# EAGLE design esp32-pico-d4 (EAGLE 9.6.2)
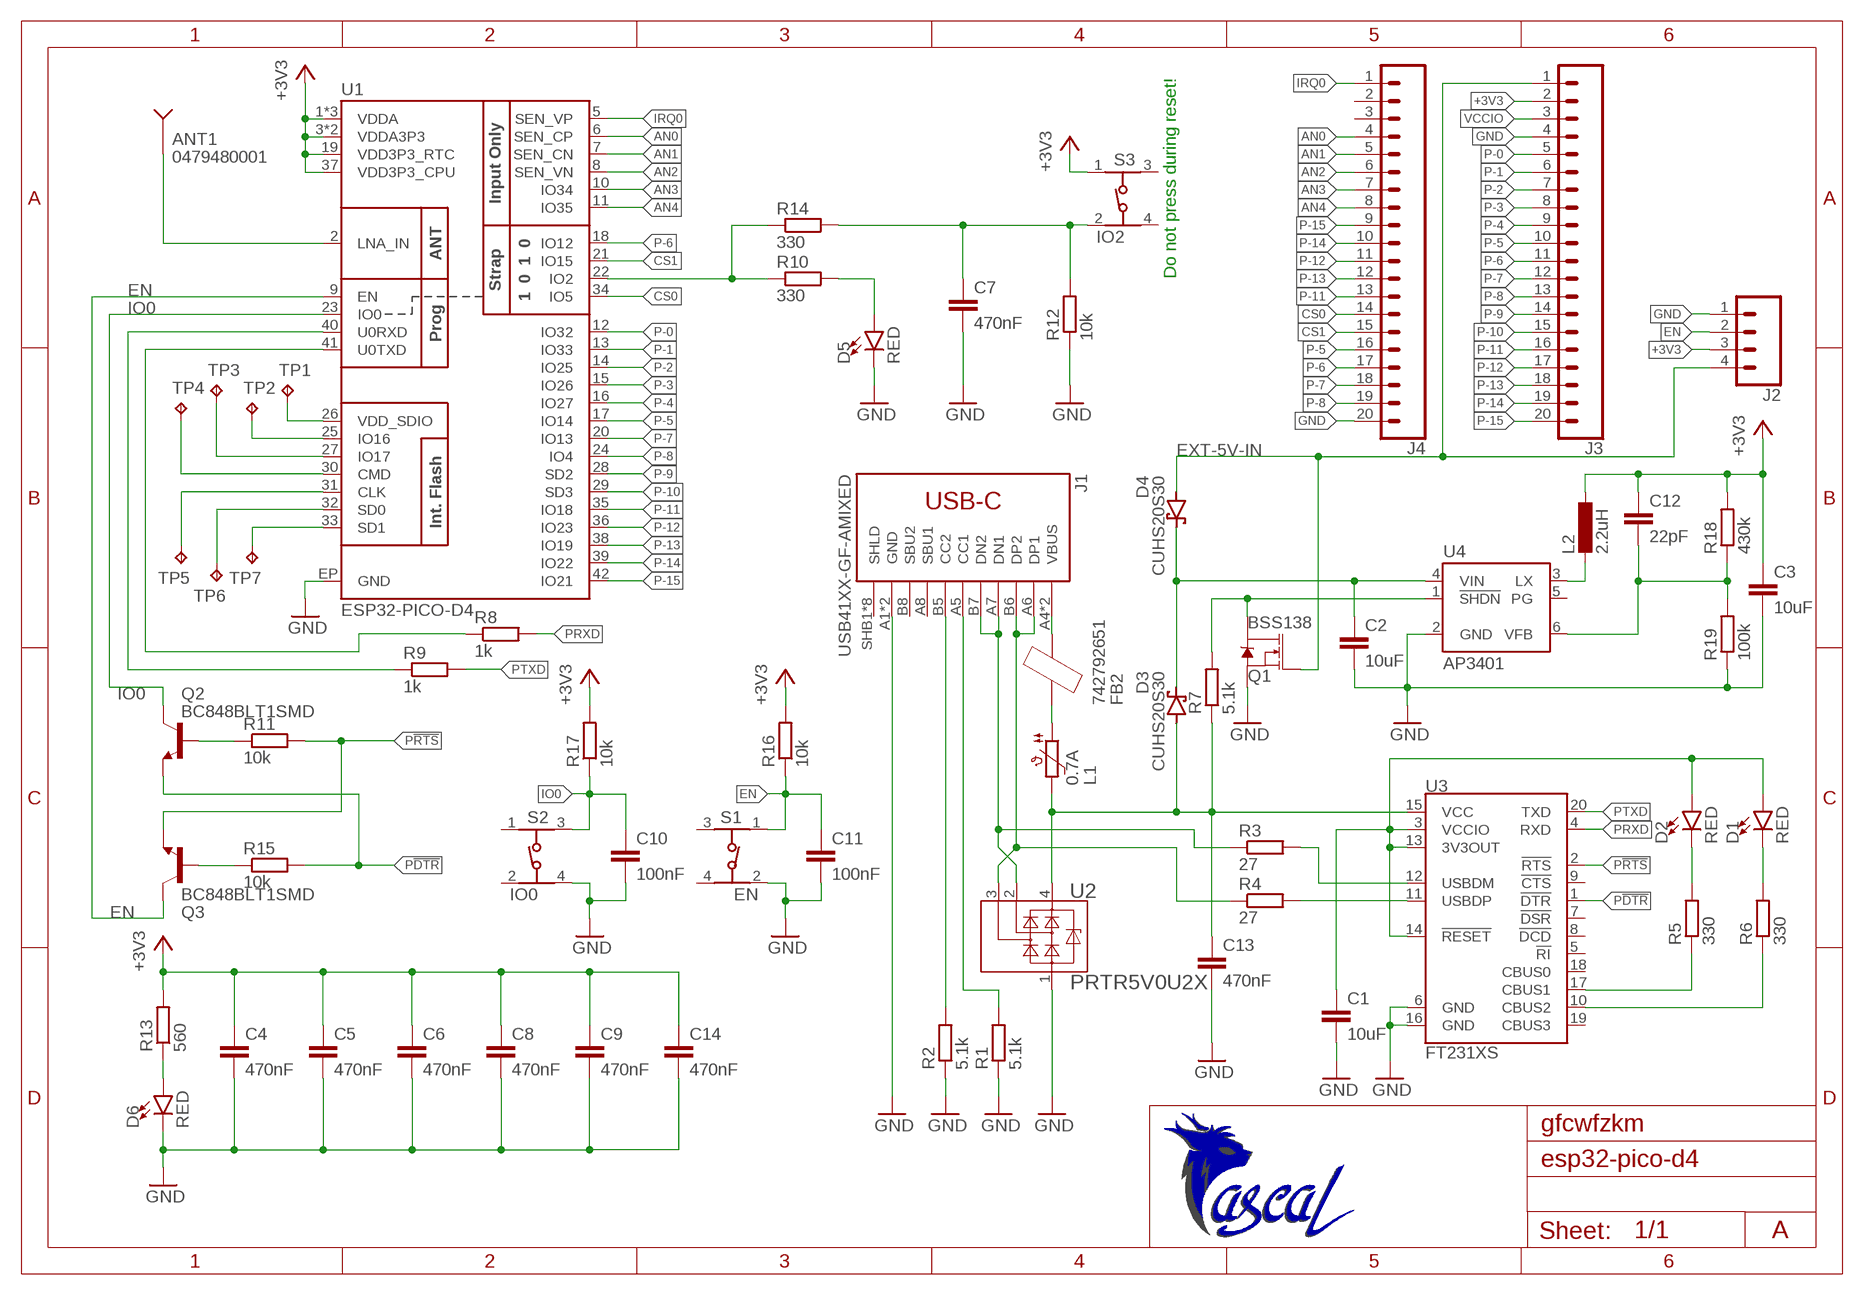
[diagram p0: schematic, sheet 1]

## Parts
ANT1  0479480001  ANT2.4G_MOLEX_0479480001  [RFANT2.4G_MOLEX_0479480001]
C1  10uF  C-EUC0603  [C0603]
C2  10uF  C-EUC0603  [C0603]
C3  10uF  C-EUC0603  [C0603]
C4  470nF  C-EUC0603  [C0603]
C5  470nF  C-EUC0603  [C0603]
C6  470nF  C-EUC0603  [C0603]
C7  470nF  C-EUC0603  [C0603]
C8  470nF  C-EUC0603  [C0603]
C9  470nF  C-EUC0603  [C0603]
C10  100nF  C-EUC0603  [C0603]
C11  100nF  C-EUC0603  [C0603]
C12  22pF  C-EUC0603  [C0603]
C13  470nF  C-EUC0603  [C0603]
C14  470nF  C-EUC0603  [C0603]
D1  RED  LED-RED0603  [LED-0603]
D2  RED  LED-RED0603  [LED-0603]
D3  CUHS20S30  [US2H]
D4  CUHS20S30  [US2H]
D5  RED  LED-RED0603  [LED-0603]
D6  RED  LED-RED0603  [LED-0603]
FB2  742792651  FERRITE_BEAD  [R0603]
J1  USB41XX-GF-AMIXED  [USB4105-GF-A]
J2  CONN_04  [1X04]
J3  CONN_20  [1X20]
J4  CONN_20  [1X20]
L1  0.7A  PTC_FUSE0805  [R0805]
L2  2.2uH  L0805  [R0805]
Q1  BSS138  MOSFET-NCH-BSS138  [SOT23-3]
Q2  BC848BLT1SMD  [SOT23]
Q3  BC848BLT1SMD  [SOT23]
R1  5.1k  R-EU_R0603  [R0603]
R2  5.1k  R-EU_R0603  [R0603]
R3  27  R-EU_R0603  [R0603]
R4  27  R-EU_R0603  [R0603]
R5  330  R-EU_R0603  [R0603]
R6  330  R-EU_R0603  [R0603]
R7  5.1k  R-EU_R0603  [R0603]
R8  1k  R-EU_R0603  [R0603]
R9  1k  R-EU_R0603  [R0603]
R10  330  R-EU_R0603  [R0603]
R11  10k  R-EU_R0603  [R0603]
R12  10k  R-EU_R0603  [R0603]
R13  560  R-EU_R0603  [R0603]
R14  330  R-EU_R0603  [R0603]
R15  10k  R-EU_R0603  [R0603]
R16  10k  R-EU_R0603  [R0603]
R17  10k  R-EU_R0603  [R0603]
R18  430k  R-EU_R0603  [R0603]
R19  100k  R-EU_R0603  [R0603]
S1  EN  434153017835  [434153017835]
S2  IO0  434153017835  [434153017835]
S3  IO2  434153017835  [434153017835]
TP1  TPB1,27  [B1,27]
TP2  TPB1,27  [B1,27]
TP3  TPB1,27  [B1,27]
TP4  TPB1,27  [B1,27]
TP5  TPB1,27  [B1,27]
TP6  TPB1,27  [B1,27]
TP7  TPB1,27  [B1,27]
U1  ESP32-PICO-D4  [QFN-48-ESP32]
U2  PRTR5V0U2X  [SOT143B]
U3  FT231XS  [SSOP20_L]
U4  AP3401  [TSOT23-6]
U$1  LOGO_PASCAL_GESELL10MM  [LOGO_10MM]

## Nets
!SHDN: Q1.3(D) R7.2 U4.1(!SHDN)
+3V3: C3.1 C4.1 C5.1 C6.1 C8.1 C9.1 C12.1 C14.1 J2.3 J3.2 L2.1 R13.2 R16.2 R17.2 R18.2 S3.1 U1.1(VDDA) U1.3(VDDA3P3) U1.4(VDDA3P3) U1.19(VDD3P3_RTC) U1.37(VDD3P3_CPU) U1.43(VDDA) U1.46(VDDA)
AN0: J4.4 U1.6(SEN_CP)
AN1: J4.5 U1.7(SEN_CN)
AN2: J4.6 U1.8(SEN_VN)
AN3: J4.7 U1.10(IO34)
AN4: J4.8 U1.11(IO35)
CS0: J4.14 U1.34(IO5)
CS1: J4.15 U1.21(IO15)
EN: C11.1 J2.2 Q3.3(C) R16.1 S1.1 U1.9(EN)
EXT-5V-IN: D4.A J2.4 J3.1 Q1.1(G)
GND: C1.2 C2.2 C3.2 C4.2 C5.2 C6.2 C7.2 C8.2 C9.2 C10.2 C11.2 C13.2 C14.2 D5.C D6.C J1.A1(GND) J1.B1(GND) J2.1 J3.4 J4.20 Q1.2(S) R1.1 R2.1 R12.1 R19.1 S1.2 S2.4 U1.EP(GND) U2.1 U3.6(GND) U3.16(GND) U4.2(GND)
IO0: C10.1 Q2.3(C) R17.1 S2.3 U1.23(IO0)
IRQ0: J4.1 U1.5(SEN_VP)
LEDBTN: R10.1 R14.1 U1.22(IO2)
LX: L2.2 U4.3(LX)
N$1: ANT1.RF(ANTENNA) U1.2(LNA_IN)
N$2: J1.B5(CC2) R2.2
N$3: J1.A5(CC1) R1.2
N$4: C13.1 D3.A L1.2 R7.1 U2.4 U3.15(VCC)
N$5: FB2.1 L1.1
N$6: J1.A6(DP1) J1.B6(DP2) R4.1 U2.3
N$7: J1.A7(DN1) J1.B7(DN2) R3.1 U2.2
N$8: R4.2 U3.11(USBDP)
N$9: C1.1 D1.A D2.A U3.3(VCCIO) U3.13(3V3OUT) U3.14(!RESET)
N$10: R3.2 U3.12(USBDM)
N$11: D2.C R5.2
N$12: D1.C R6.2
N$13: R5.1 U3.17(CBUS1)
N$14: R6.1 U3.10(CBUS2)
N$16: R8.1 U1.41(U0TXD)
N$17: R9.1 U1.40(U0RXD)
N$18: Q3.1(B) R15.1
N$19: D5.A R10.2
N$20: C7.1 R12.2 R14.2 S3.2
N$21: D6.A R13.1
N$22: Q2.1(B) R11.1
N$23: TP1.TP U1.26(VDD_SDIO)
N$24: TP2.TP U1.25(IO16)
N$25: TP3.TP U1.27(IO17)
N$26: TP4.TP U1.30(CMD)
N$27: TP7.TP U1.33(SD1)
N$28: TP6.TP U1.32(SD0)
N$29: TP5.TP U1.31(CLK)
P!DTR: Q2.2(E) R15.2 U3.1(!DTR)
P!RTS: Q3.2(E) R11.2 U3.2(!RTS)
P-0: J3.5 U1.12(IO32)
P-1: J3.6 U1.13(IO33)
P-2: J3.7 U1.14(IO25)
P-3: J3.8 U1.15(IO26)
P-4: J3.9 U1.16(IO27)
P-5: J3.10 J4.16 U1.17(IO14)
P-6: J3.11 J4.17 U1.18(IO12)
P-7: J3.12 J4.18 U1.20(IO13)
P-8: J3.13 J4.19 U1.24(IO4)
P-9: J3.14 U1.28(SD2)
P-10: J3.15 U1.29(SD3)
P-11: J3.16 J4.13 U1.35(IO18)
P-12: J3.17 J4.11 U1.36(IO23)
P-13: J3.18 J4.12 U1.38(IO19)
P-14: J3.19 J4.10 U1.39(IO22)
P-15: J3.20 J4.9 U1.42(IO21)
PRXD: R8.2 U3.4(RXD)
PTXD: R9.2 U3.20(TXD)
VBUS: FB2.2 J1.A4(VBUS) J1.B4(VBUS)
VCCIO: J3.3
VFB: C12.2 R18.1 R19.2 U4.6(VFB)
VIN: C2.1 D3.C D4.C U4.4(VIN)
Unconnected: J1.A8(SBU1) J1.B8(SBU2) J1.SHB1(SHLD) J1.SHB2(SHLD) J1.SHB3(SHLD) J1.SHB4(SHLD) J1.SHT1(SHLD) J1.SHT2(SHLD) J1.SHT3(SHLD) J1.SHT4(SHLD) J4.2 J4.3 S1.3 S1.4 S2.1 S2.2 S3.3 S3.4 U3.5(!RI) U3.7(!DSR) U3.8(!DCD) U3.9(!CTS) U3.18(CBUS0) U3.19(CBUS3) U4.5(PG)

## Notes on the sheet
- Do not press during reset!
- gfcwfzkm
- A

## Library data of the parts
ANT1 = Pascal_Library:ANT2.4G_MOLEX_0479480001: https://www.digikey.ch/product-detail/de/molex/0479480001/WM4893CT-ND/2683664
C1-C14 = rcl:C-EU: CAPACITOR, European symbol; SPICEPREFIX: C
D1 D2 D5 D6 = SparkFun-LED:LED-RED: Red SMD LED Used in manufacturing of most products at SparkFun Packages: 0603 - SMD 0603 package [Product Link] <http://docs.avagotech.com/docs/AV02-0551EN> 0603 SMART - SMD 0603 SMART package ( more efficient and expensive)[Product Link] <http://www.osram-os.com/Graphics/XPic2/00077099_0.pdf> 1206 - SMD1206 package [Product Link] <https://www.sparkfun.com/datasheets/DevTools/LilyPad/Q150OVS4.pdff> SparkFun Products: Pro Mini 328 -5V <https://www.sparkfun.com/products/821> RedBoard <https://www.sparkfun.com/products/12757> IOIO-OTG <https://www.sparkfun.com/products/13613>; PROD_ID: DIO-00819
D3 D4 = Elektroniker MGB:CUHS: CUHSxx High Speed Schottky Barrier Diode Series With a Very Low Vf Voltage CUHS15F40 <https://toshiba.semicon-storage.com/info/docget.jsp?did=63603&prodName=CUHS15F40>, CUHS20S30 <https://toshiba.semicon-storage.com/info/docget.jsp?did=63606&prodName=CUHS20S30>, CUHS20S40 <https://toshiba.semicon-storage.com/info/docget.jsp?did=63610&prodName=CUHS20S40>, CUHS20F30 <https://toshiba.semicon-storage.com/info/docget.jsp?did=63604&prodName=CUHS20F30>, CUHS20F40 <https://toshiba.semicon-storage.com/info/docget.jsp?did=63600&prodName=CUHS20F40>
FB2 = Elektroniker MGB:FERRITE_BEAD
J1 = Pascal_Library:USB41XX-GF-A
J2 = SparkFun-Connectors:CONN_04: Multi connection point. Often used as Generic Header-pin footprint for 0.1 inch spaced/style header connections On any of the 0.1 inch spaced packages, you can populate with these: Break Away Headers - Straight <https://www.sparkfun.com/products/116> (PRT-00116) Break Away Male Headers - Right Angle <https://www.sparkfun.com/products/553> (PRT-00553) Female Headers <https://www.sparkfun.com/products/115> (PRT-00115) Break Away Headers - Machine Pin <https://www.sparkfun.com/products/117> (PRT-00117) Break Away Female Headers - Swiss Machine Pin <https://www.sparkfun.com/products/743> (PRT-00743) For SCREWTERMINALS and SPRING TERMINALS visit here: Screw Terimnals on SparkFun.com <https://www.sparkfun.com/search/results?term=Screw+Terminals> (5mm/3.5mm/2.54mm spacing) This device is also useful as a general connection point to wire up your design to another part of your project. Our various solder wires solder well into these plated through hole pads. Hook-Up Wire - Assortment (Stranded, 22 AWG) <https://www.sparkfun.com/products/11375> (PRT-11375) Hook-Up Wire - Assortment (Solid Core, 22 AWG) <https://www.sparkfun.com/products/11367> (PRT-11367) View the entire wire category on our website here <https://www.sparkfun.com/categories/141> Special notes: Molex polarized connector foot print use with SKU : PRT-08231 with associated crimp pins and housings. 1MM SMD Version SKU: PRT-10208; PROD_ID: CONN-09696
J3 J4 = SparkFun-Connectors:CONN_20: Multi connection point. Often used as Generic Header-pin footprint for 0.1 inch spaced/style header connections On any of the 0.1 inch spaced packages, you can populate with these: Break Away Headers - Straight <https://www.sparkfun.com/products/116> (PRT-00116) Break Away Male Headers - Right Angle <https://www.sparkfun.com/products/553> (PRT-00553) Female Headers <https://www.sparkfun.com/products/115> (PRT-00115) Break Away Headers - Machine Pin <https://www.sparkfun.com/products/117> (PRT-00117) Break Away Female Headers - Swiss Machine Pin <https://www.sparkfun.com/products/743> (PRT-00743) For SCREWTERMINALS and SPRING TERMINALS visit here: Screw Terimnals on SparkFun.com <https://www.sparkfun.com/search/results?term=Screw+Terminals> (5mm/3.5mm/2.54mm spacing) This device is also useful as a general connection point to wire up your design to another part of your project. Our various solder wires solder well into these plated through hole pads. Hook-Up Wire - Assortment (Stranded, 22 AWG) <https://www.sparkfun.com/products/11375> (PRT-11375) Hook-Up Wire - Assortment (Solid Core, 22 AWG) <https://www.sparkfun.com/products/11367> (PRT-11367) View the entire wire category on our website here <https://www.sparkfun.com/categories/141> Special notes: Molex polarized connector foot print use with SKU : PRT-08231 with associated crimp pins and housings. 1MM SMD Version SKU: PRT-10208 NOTES ON THE VARIANTS LOCK and LOCK_LONGPADS... This footprint was designed to help hold the alignment of a through-hole component (i.e. 6-pin header) while soldering it into place. You may notice that each hole has been shifted either up or down by 0.005 of an inch from it's more standard position (which is a perfectly straight line). This slight alteration caused the pins (the squares in the middle) to touch the edges of the holes. Because they are alternating, it causes a "brace" to hold the component in place. 0.005 has proven to be the perfect amount of "off-center" position when using our standard breakaway headers. Although looks a little odd when you look at the bare footprint, once you have a header in there, the alteration is very hard to notice. Also,if you push a header all the way into place, it is covered up entirely on the bottom side. Note about LOCK SPECIAL package: This is just like the LOCK variant in that the holes are staggared by 5 mil, but except for the last two holes. They are not altered from the "standard" footprint layout. This is used for a special purpose on the layout of our Graphic LCD Backpack. Make sure you want to use this device before selecting it for you project!
L1 = Elektroniker MGB:PTC_FUSE
L2 = Pascal_Library:L
Q1 = SparkFun-DiscreteSemi:MOSFET-NCH: N-channel MOSFETs Voltage controlled devices that allow control of high current outputs. SparkFun Products: SparkFun OpenScale <https://www.sparkfun.com/products/13261> SparkFun Digital Sandbox <https://www.sparkfun.com/products/12651> SparkFun Monster Moto Shield <https://www.sparkfun.com/products/10182> SparkFun MOSFET Power Controller <https://www.sparkfun.com/products/11214>; PROD_ID: TRANS-00830; VALUE: 220mA/50V/3.5Ω
Q2 Q3 = transistor-npn:BC848*: NPN Transistor
R1-R19 = rcl:R-EU_: RESISTOR, European symbol; SPICEPREFIX: R
S1-S3 = Wurth_Switch_WS-TASV:434153017835: WS-TASV J-Bend SMT Tact Switch 3.5x2.9 mm Material Properties Cover Material : Stainless Steel Properties Actuator Material:LCP Actuator Flammability Rating:UL94 V-0 Actuator Color:Blue Frame Material:PA46 Frame Flammability Rating:UL94 HB Frame Color:Black Contact Material:Stainless Steel Contact Plating:Silver Terminal Material:Copper Alloy Terminal Plating:Silver VR:12 V (DC) Contact Resistance Initial:100 mΩ Contact Resistance After Life Test:1 Ω RISO:100 MΩ Withstanding Voltage:250 V (AC) Washable:No Qty.:4000 Mechanical Properties Stroke :0.15 mm General Information Operating Temperature:-40 up to +85 °C Washable:No Packaging Properties Packaging:Tape and Reel <https://www.we-online.com/catalog/media/o72753v209%20WS-TASU_434331013822_a_4C.jpg> Details see: https://www.we-online.com/catalog/en/TASV_3_5X2_9_SMD_J-BEND/ Updated by yingchun,Shan;2020-02-18 2020(C) Würth Elektronik; DATASHEET-URL: https://www.we-online.com/catalog/datasheet/434153017835.pdf; H: 1.7mm; OPERATION-FORCE: 350g; PART-NUMBER: 434153017835; QTY: 4000
TP1-TP7 = testpad:TP: Test pad
U1 = Pascal_Library:ESP32-PICO-D4: https://www.digikey.ch/product-detail/de/espressif-systems/ESP32-PICO-D4/1904-1029-1-ND/9381738
U2 = Elektroniker MGB:PRTR5V0U2X: PRTR5V0U2X - Ultra low capacitance double rail-to-rail ESD protection diode Ultra low capacitance rail-to-rail ElectroStatic Discharge (ESD) protection diode in a small SOT143B Surface-Mounted Device (SMD) plastic package designed to protect two Hi-Speed data lines or high-frequency signal lines from the damage caused by ESD and other transients. PRTR5V0U2X incorporates two pairs of ultra low capacitance rail-to-rail diodes as well as an additional ESD protection diode to ensure signal line protection even if no supply voltage is available.
U3 = SparkFun-IC-Comms:FT231X: FTDI FT231X Full Speed USB to Full-handshake UART This USB2.0 Full Speed IC offers a compact bridge to full handshake UART interfaces. The device is a UART, capable of operating up to 3MBaud, with low power consumption (8mA). The FT231X includes the complete FT-X series feature set and enables USB to be added into a system design quickly and easily over a UART interface. Datasheet <http://cdn.sparkfun.com/datasheets/Components/General%20IC/DS_FT231X.pdf> SparkFun Products SparkFun RedBoard - Programmed with Arduino <https://www.sparkfun.com/products/12757> (DEV-12757) SparkFun XBee Explorer USB <https://www.sparkfun.com/products/11812> (WRL-11812) SparkFun XBee Explorer Dongle <https://www.sparkfun.com/products/11697> (WRL-11697) SparkFun Blynk Board - ESP8266 <https://www.sparkfun.com/products/13794> (WRL-13794) SparkFun ESP8266 Thing - Dev Board <https://www.sparkfun.com/products/13711> (WRL-13711) SparkFun Block for Intel® Edison - Base <https://www.sparkfun.com/products/13045> (DEV-13045) SparkFun RedStick <https://www.sparkfun.com/products/13741> (DEV-13741) SparkFun Beefy 3 - FTDI Basic Breakout <https://www.sparkfun.com/products/13746> (DEV-13746) SparkFun FT231X Breakout <https://www.sparkfun.com/products/11736> (BOB-11736); PROD_ID: IC-11524
U4 = Pascal_Library:AP3401
U$1 = Pascal_Library:LOGO_PASCAL_GESELL: Mein Logo halt

## Board
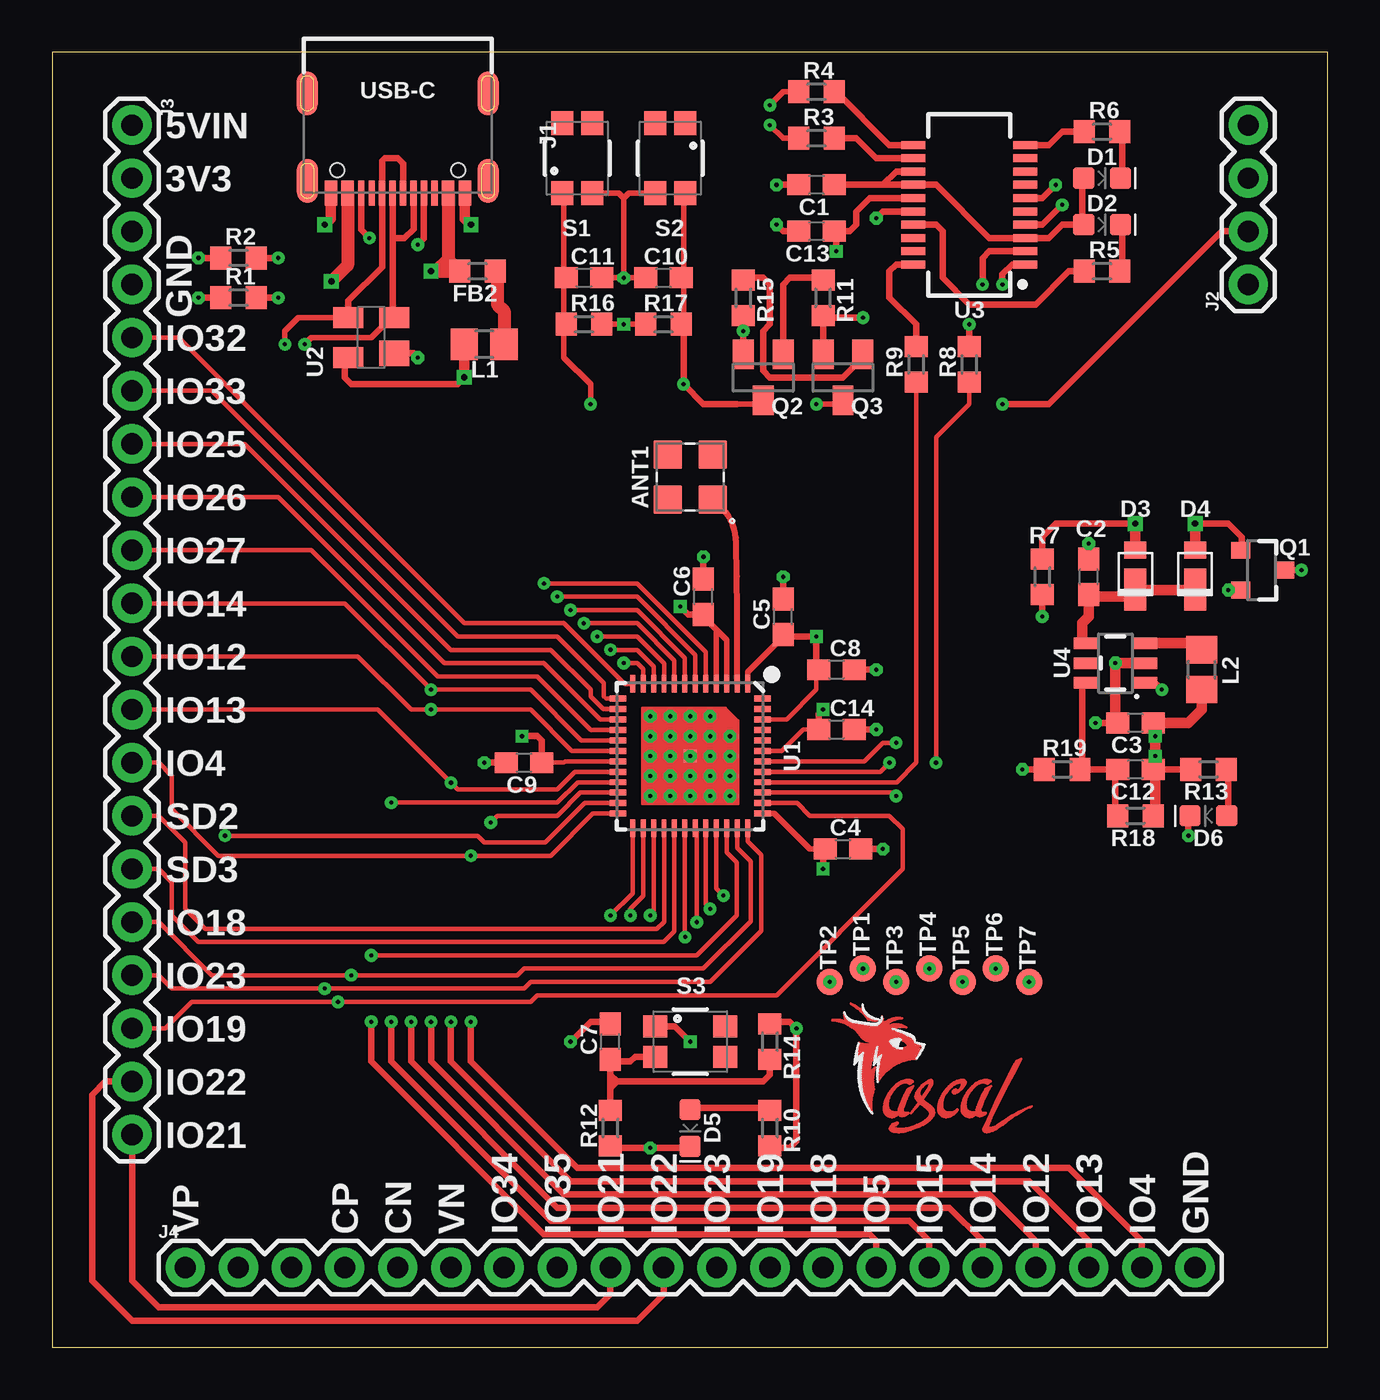
[diagram p1: board, top side]
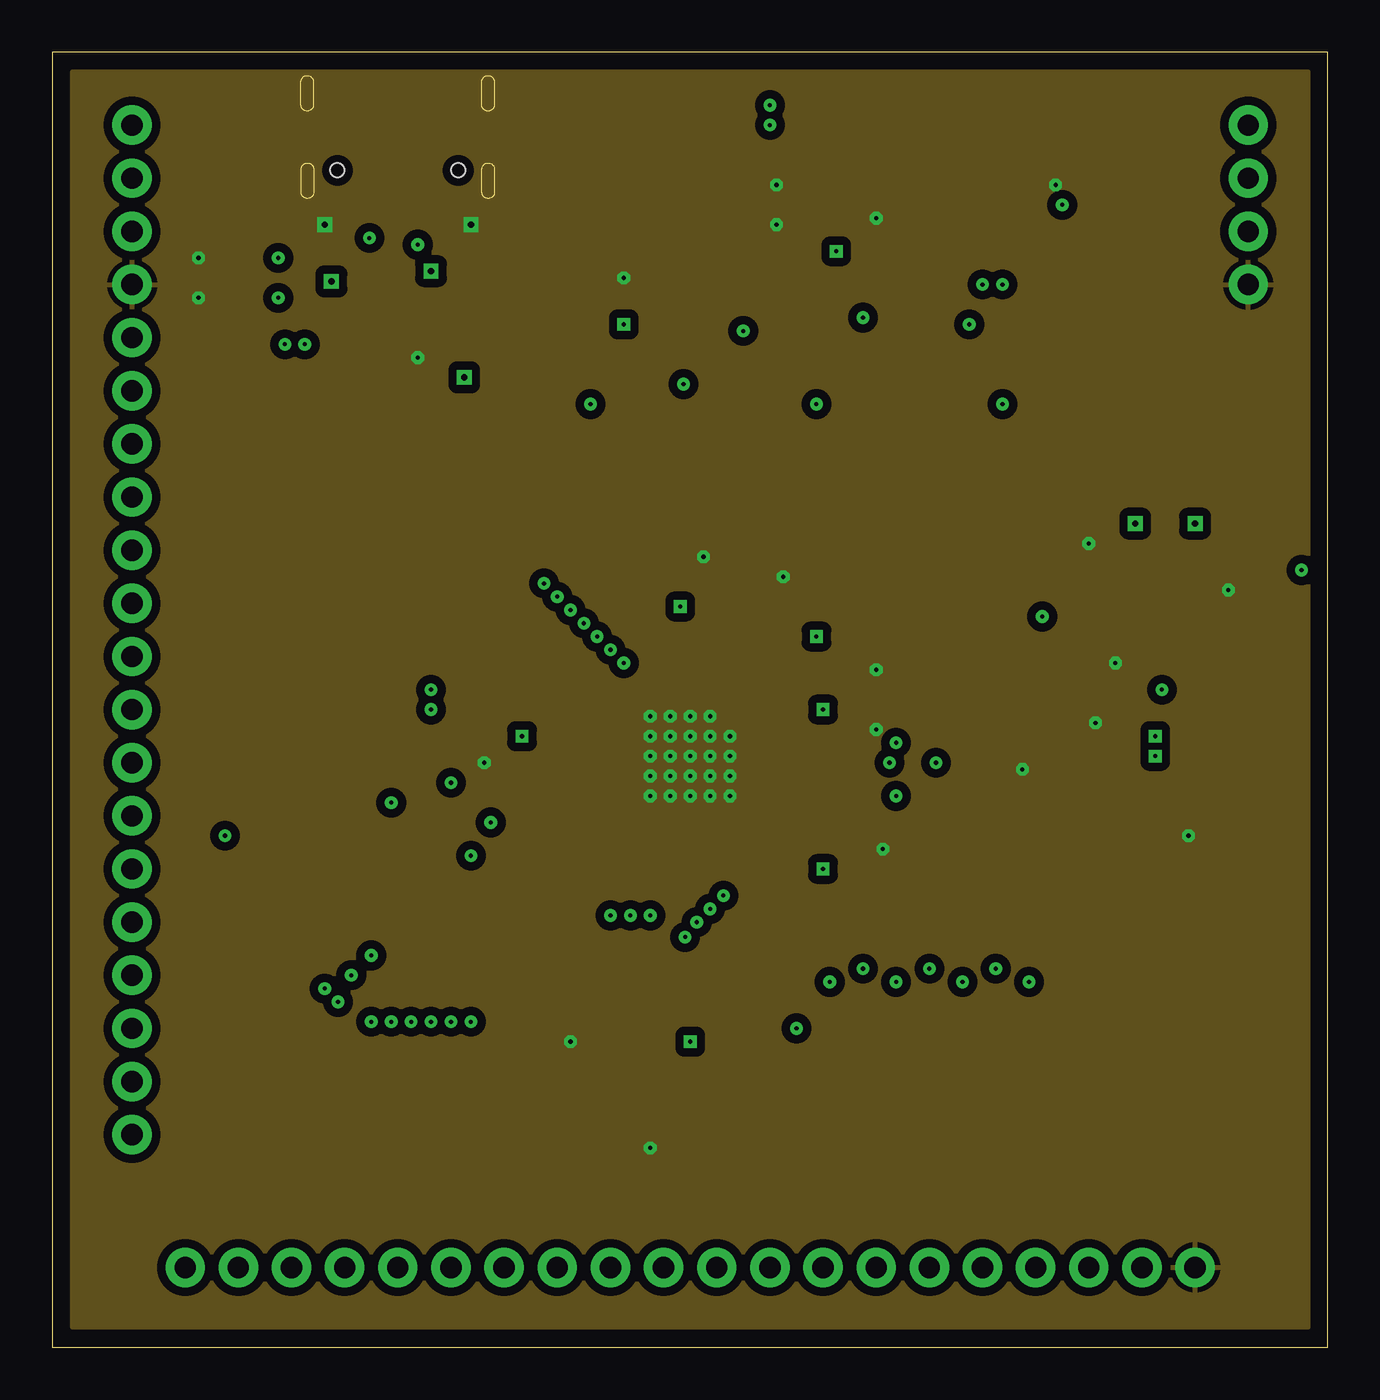
[diagram p2: board, inner layer Route2]
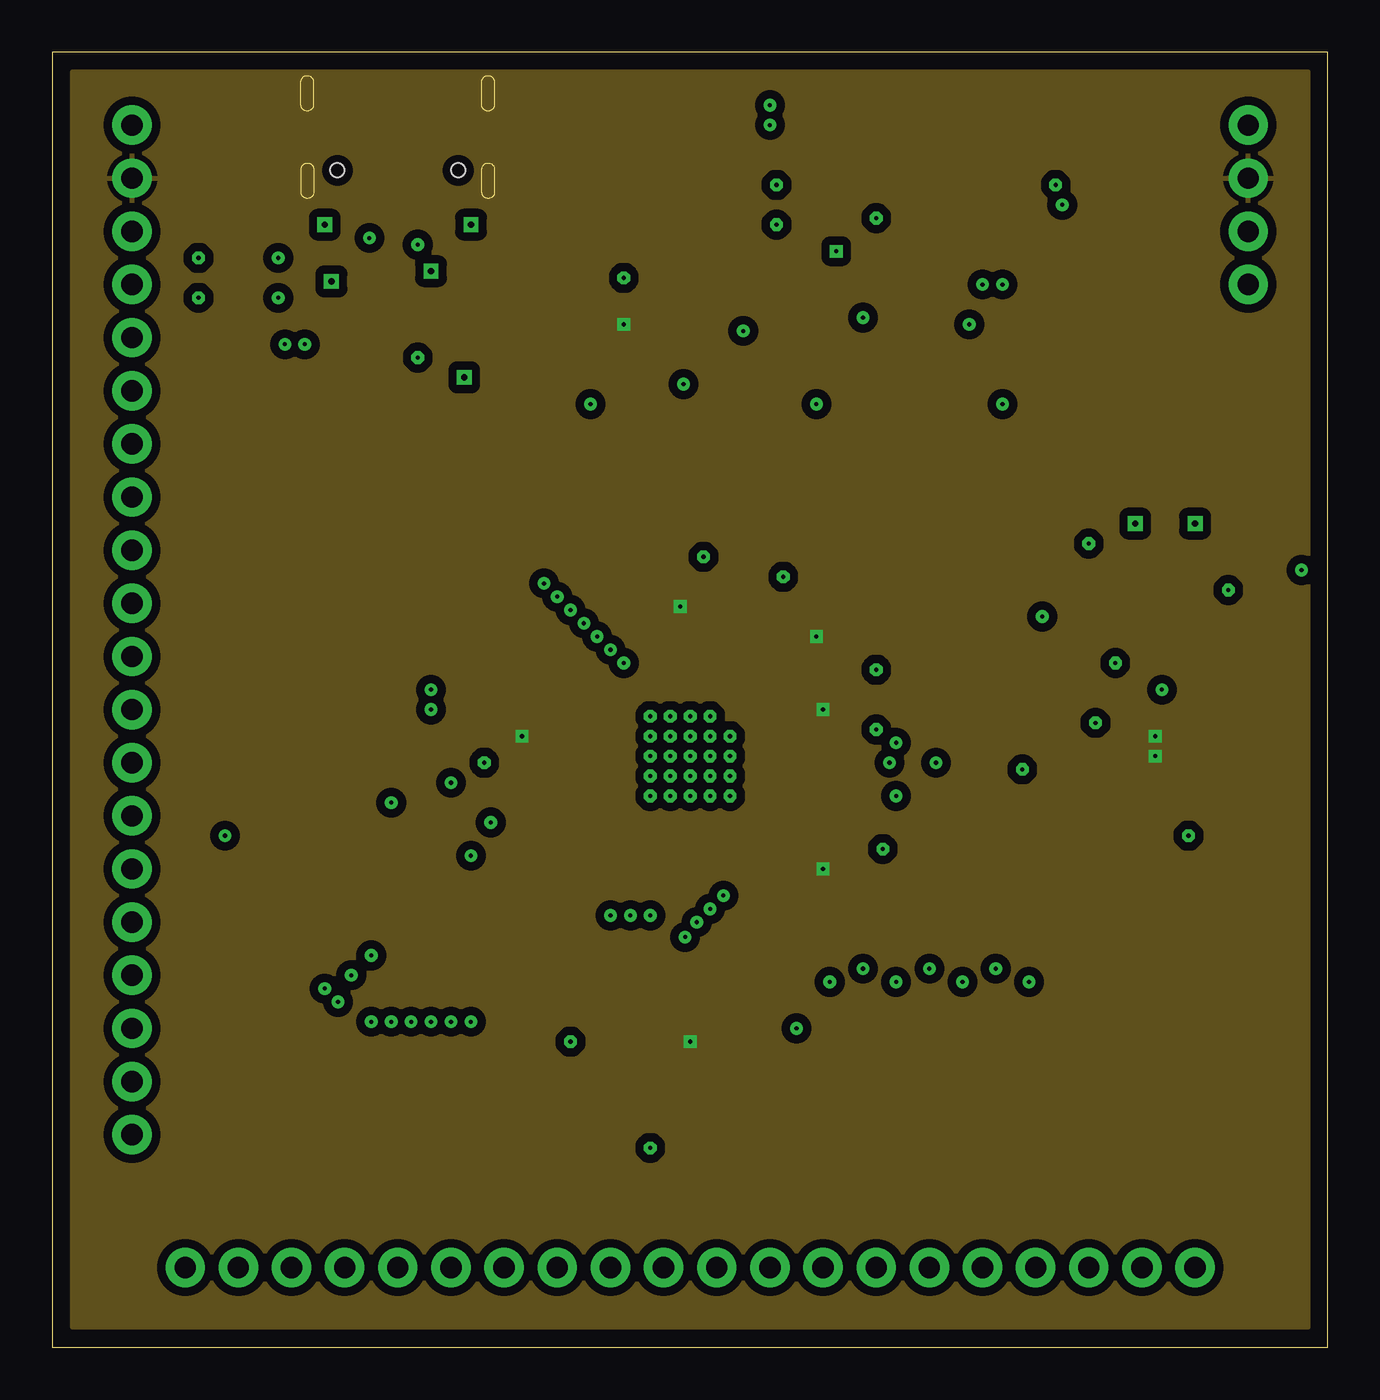
[diagram p3: board, inner layer Route15]
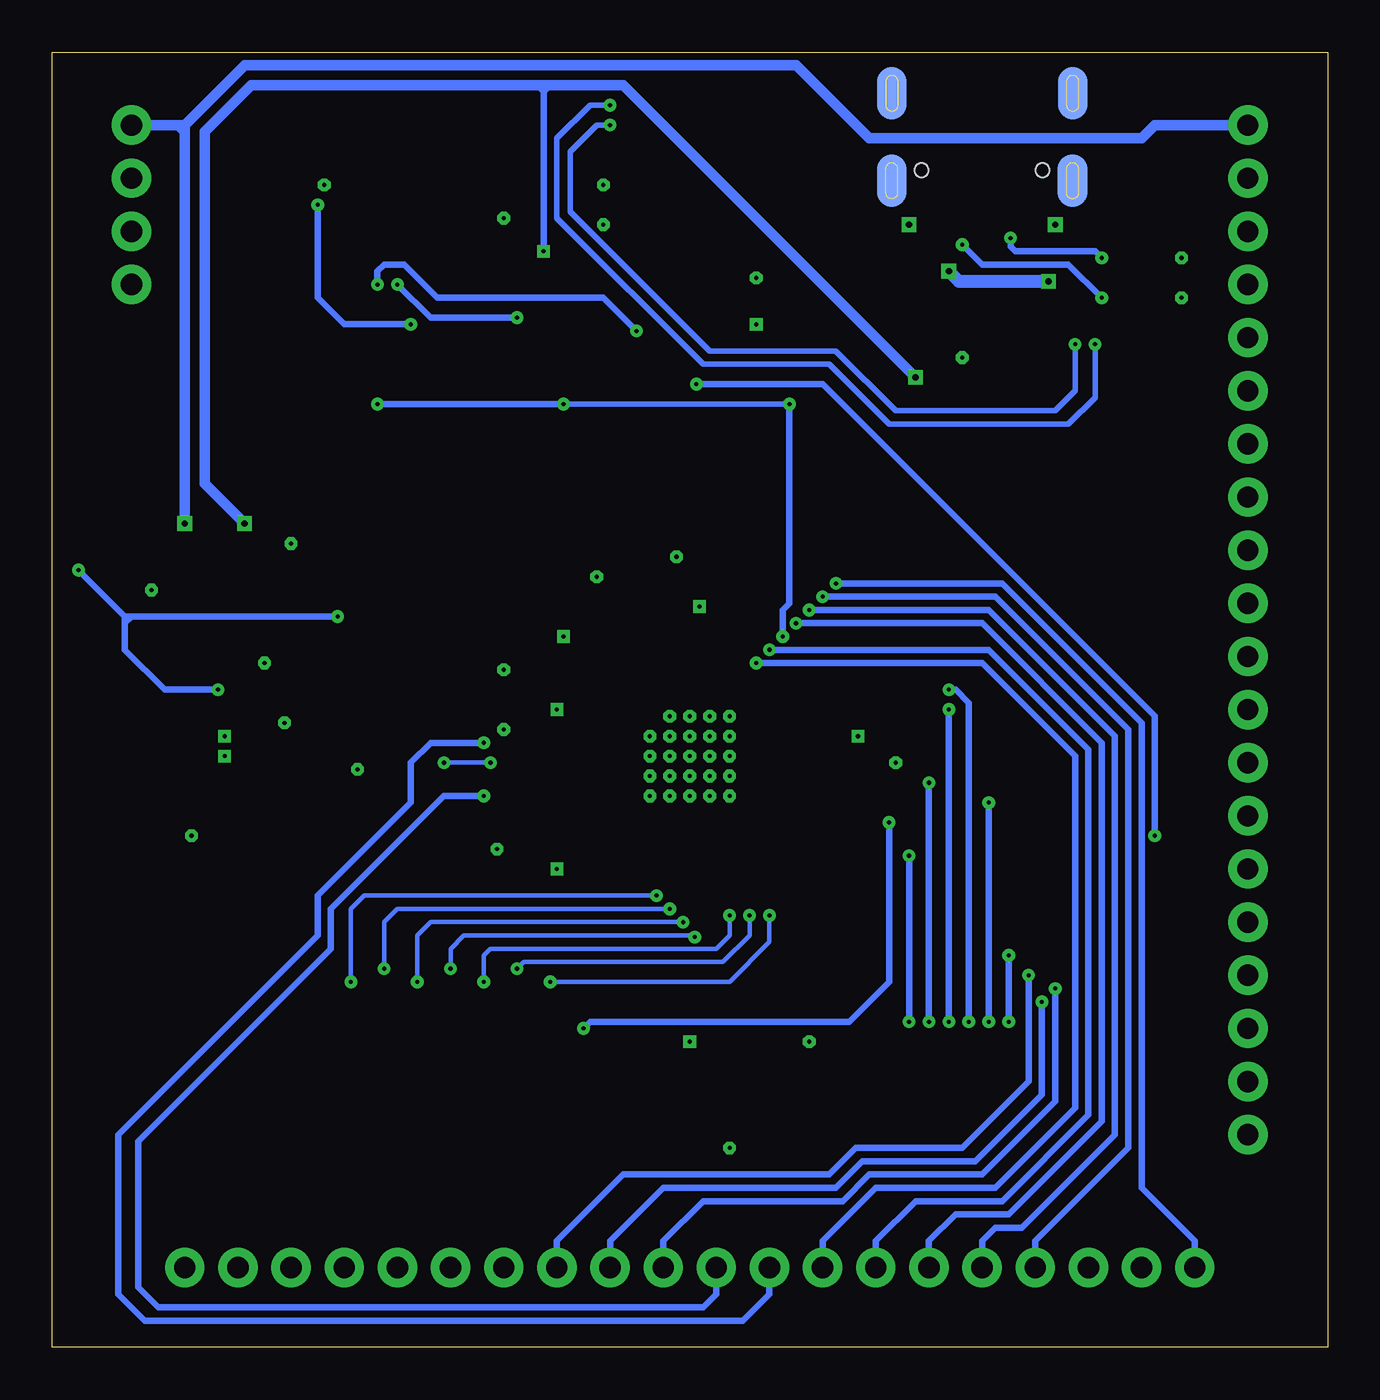
[diagram p4: board, bottom side, seen from below]

Size 60.94 x 61.9 mm. Coordinates in mm from the lower left corner, seen from the top.
Outline: 0,0 60.94,0 60.94,61.9 0,61.9 0,0
Copper layers (1+2*15+16): Top 0.035mm / dielectric 0.2mm / Route2 0.035mm / dielectric 1mm / Route15 0.035mm / dielectric 0.2mm / Bottom 0.035mm
Design rules "jlcpcb_4_layers": minimum track width 5mil, minimum drill 0.2mm, track to track 5mil, track to pad 6mil, pad to pad 6mil, via to via 6mil, smd to smd 6mil, copper to edge 0mil, drill to drill 6mil, minimum pad ring 10mil, minimum via ring 8mil, stop-mask expansion 4mil, vias tented up to drill 0mil, thermal gap 10mil

### Footprints (pad centres in the part's own frame; a part is rotated, then mirrored left to right if it is on the bottom)
RFANT2.4G_MOLEX_0479480001 = smd 1.35 x 1.35: NC1 1.075,-1.075; NC2 1.075,1.075; NC3 -1.075,1.075; RF -1.075,-1.075
C0603 = smd 1.1 x 1: 1 -0.85,0; 2 0.85,0
LED-0603 = smd 1 x 1: A -0.877,0; C 0.877,0
US2H = smd 0.8 x 1.1: A 0.65,0 | smd 2 x 1.1: C -1.25,0
R0603 = smd 1 x 1.1: 1 -0.85,0; 2 0.85,0
USB4105-GF-A = smd 0.6 x 1.2: A1 -3.2,4.53; A4 -2.4,4.53; B1 3.2,4.53; B4 2.4,4.53 | smd 0.3 x 1.2: A5 -1.25,4.53; A6 -0.25,4.53; A7 0.25,4.53; A8 1.25,4.53; B5 1.75,4.53; B6 0.75,4.53; B7 -0.75,4.53; B8 -1.75,4.53 | smd 1.4 x 2.5 bottom: SHB1 -4.32,3.93; SHB2 -4.31,-0.25; SHB3 4.32,3.93; SHB4 4.33,-0.25 | smd 1 x 2.1: SHT1 -4.32,3.93; SHT2 -4.31,-0.25; SHT3 4.32,3.93; SHT4 4.33,-0.25 | hole 0.65: -2.89,3.43; 2.89,3.43
1X04 = drill 1.016 pad 1.88: 1 0,0; 2 2.54,0; 3 5.08,0; 4 7.62,0
1X20 = drill 1.016 pad 1.88: 1 0,0; 2 2.54,0; 3 5.08,0; 4 7.62,0; 5 10.16,0; 6 12.7,0; 7 15.24,0; 8 17.78,0; 9 20.32,0; 10 22.86,0; 11 25.4,0; 12 27.94,0; 13 30.48,0; 14 33.02,0; 15 35.56,0; 16 38.1,0; 17 40.64,0; 18 43.18,0; 19 45.72,0; 20 48.26,0
R0805 = smd 1.3 x 1.5: 1 -0.95,0; 2 0.95,0
SOT23-3 = smd 0.8 x 0.9: 1 -0.95,-1; 2 0.95,-1; 3 0,1.1
SOT23 = smd 1 x 1.4: 1 -0.95,-1.1; 2 0.95,-1.1; 3 0,1.1
434153017835 = smd 1.15 x 1.05: 1 -1.675,0.725; 2 -1.675,-0.725; 3 1.675,0.725; 4 1.675,-0.725
B1,27 = smd 1.27 x 1.27: TP 0,0
QFN-48-ESP32 = smd 0.8 x 0.25: 1 -3.45,2.75; 2 -3.45,2.25; 3 -3.45,1.75; 4 -3.45,1.25; 5 -3.45,0.75; 6 -3.45,0.25; 7 -3.45,-0.25; 8 -3.45,-0.75; 9 -3.45,-1.25; 10 -3.45,-1.75; 11 -3.45,-2.25; 12 -3.45,-2.75; 25 3.45,-2.75; 26 3.45,-2.25; 27 3.45,-1.75; 28 3.45,-1.25; 29 3.45,-0.75; 30 3.45,-0.25; 31 3.45,0.25; 32 3.45,0.75; 33 3.45,1.25; 34 3.45,1.75; 35 3.45,2.25; 36 3.45,2.75 | smd 0.25 x 0.8: 13 -2.75,-3.45; 14 -2.25,-3.45; 15 -1.75,-3.45; 16 -1.25,-3.45; 17 -0.75,-3.45; 18 -0.25,-3.45; 19 0.25,-3.45; 20 0.75,-3.45; 21 1.25,-3.45; 22 1.75,-3.45; 23 2.25,-3.45; 24 2.75,-3.45; 37 2.75,3.45; 38 2.25,3.45; 39 1.75,3.45; 40 1.25,3.45; 41 0.75,3.45; 42 0.25,3.45; 43 -0.25,3.45; 44 -0.75,3.45; 45 -1.25,3.45; 46 -1.75,3.45; 47 -2.25,3.45; 48 -2.75,3.45 | smd 0.635 x 0.635: EP 0,0
SOT143B = smd 1.2 x 1.44: 1 -0.75,-1.1 | smd 1 x 1.44: 2 0.95,-1.1; 3 0.95,1.1; 4 -0.95,1.1
SSOP20_L = smd 0.381 x 1.143: 1 -2.857,-2.68; 2 -2.223,-2.68; 3 -1.587,-2.68; 4 -0.953,-2.68; 5 -0.318,-2.68; 6 0.318,-2.68; 7 0.953,-2.68; 8 1.587,-2.68; 9 2.223,-2.68; 10 2.857,-2.68; 11 2.857,2.68; 12 2.223,2.68; 13 1.587,2.68; 14 0.953,2.68; 15 0.318,2.68; 16 -0.318,2.68; 17 -0.953,2.68; 18 -1.587,2.68; 19 -2.223,2.68; 20 -2.857,2.68
TSOT23-6 = smd 0.55 x 1.2: 1 -0.95,-1.4; 2 0,-1.4; 3 0.95,-1.4; 4 0.95,1.4; 5 0,1.4; 6 -0.95,1.4

### Placement (x,y rotation side)
ANT1  30.48,41.59 90 top
C1  36.51,55.56 180 top
C2  49.53,36.83 90 top
C3  51.75,29.84 180 top
C4  37.78,23.81 0 top
C5  34.92,34.92 90 top
C6  31.11,35.88 90 top
C7  26.67,14.61 90 top
C8  37.47,32.38 0 top
C9  22.54,27.94 180 top
C10  29.21,51.12 180 top
C11  25.4,51.12 0 top
C12  51.75,27.62 180 top
C13  36.51,53.34 180 top
C14  37.47,29.53 0 top
D1  50.16,55.88 0 top
D2  50.16,53.66 0 top
D3  51.75,37.47 90 top
D4  54.61,37.47 90 top
D5  30.48,10.48 270 top
D6  55.24,25.4 180 top
FB2  20.32,51.44 180 top
J1  16.51,59.69 180 top
J2  57.15,50.8 90 top
J3  3.81,58.42 270 top
J4  6.35,3.81 0 top
L1  20.64,47.94 180 top
L2  54.93,32.38 90 top
Q1  57.78,37.15 270 top
Q2  33.97,46.35 180 top
Q3  37.78,46.35 180 top
R1  8.89,50.16 0 top
R2  8.89,52.07 0 top
R3  36.51,57.78 0 top
R4  36.51,60.01 0 top
R5  50.16,51.44 0 top
R6  50.16,58.1 0 top
R7  47.31,36.83 270 top
R8  43.81,46.99 90 top
R9  41.27,46.99 90 top
R10  34.29,10.48 90 top
R11  36.83,50.16 270 top
R12  26.67,10.48 90 top
R13  55.24,27.62 180 top
R14  34.29,14.61 270 top
R15  33.02,50.16 270 top
R16  25.4,48.9 0 top
R17  29.21,48.9 180 top
R18  51.75,25.4 0 top
R19  48.26,27.62 0 top
S1  25.08,56.83 90 top
S2  29.53,56.83 270 top
S3  30.48,14.61 0 top
TP1  38.73,18.1 180 top
TP2  37.15,17.46 0 top
TP3  40.32,17.46 0 top
TP4  41.91,18.1 270 top
TP5  43.5,17.46 270 top
TP6  45.09,18.1 180 top
TP7  46.67,17.46 180 top
U1  30.48,28.26 270 top
U2  15.24,48.26 90 top
U3  43.81,54.61 90 top
U4  50.8,32.7 90 top
U$1  36.51,9.21 0 top

### Tracks (layer width: path | path; a pad name or v marks a point on that pad's centre or on a via)
!SHDN  (via drill 0.2)
  Top 0.305: U4.1 52.7,31.75 v53.02,31.43 | Q1.3 v59.69,37.15 | v47.31,34.92 R7.2
  Bottom 0.305: v59.69,37.15 57.47,34.92 | 57.47,34.92 57.15,34.92 | 57.15,34.92 v47.31,34.92 | v53.02,31.43 55.56,31.43 57.47,33.34 57.47,34.61 | 57.47,34.61 57.47,34.92 | 57.15,34.92 57.47,34.61
+3V3  (via drill 0.2)
  Top 0.203: U1.19 24.52,28.01 24.45,27.94 C9.1 | C8.1 36.51,32.28 36.51,31.43 35.09,30.01 U1.46 | U1.43 34.86,28.51 35.88,29.53 C14.1
  Top 0.254: U1.3 32.23,33.81 31.73,34.31 | C6.1 31.11,34.92 31.73,34.31 | U1.4 31.73,34.31 | U1.1 33.23,32.28 34.92,33.97 C5.1 | U1.37 34.5,25.51 36.2,23.81 C4.1 | R16.2 v27.3,48.9 R17.2
  Top 0.305: R13.2 C12.1 | C9.1 23.39,29 23.18,29.21 v22.44,29.21 | C8.1 36.51,32.49 v36.51,33.97 35.03,33.97 C5.1 | S3.1 29.75,15.33 v30.48,14.61 | C4.1 36.83,23.71 v36.83,22.86 | C14.1 36.62,30.27 v36.83,30.48 | C6.1 30.39,35.03 v30.01,35.41
  Top 0.508: L2.1 54.93,30.48 54.29,29.84 C3.1 52.7,29.74 v52.7,29.21 v52.7,28.26 52.7,27.73 C12.1 52.7,27.52 52.7,25.5 R18.2
  pour Route15 (isolate 0.406): 0.95,60.96 0.95,0.95 60.01,0.95 60.01,60.96
AN0  (via drill 0.2)
  Top 0.203: U1.6 30.73,33.09 27.94,35.88 v24.13,35.88
  Bottom 0.305: J4.4 13.97,5.08 9.53,9.53 9.53,29.53 15.88,35.88 v24.13,35.88
AN1  (via drill 0.2)
  Top 0.203: U1.7 30.23,32.95 27.94,35.24 v24.77,35.24
  Bottom 0.305: J4.5 16.51,5.08 15.88,5.71 14.61,5.71 10.16,10.16 10.16,29.21 16.19,35.24 v24.77,35.24
AN2  (via drill 0.2)
  Top 0.203: U1.8 29.73,32.82 27.94,34.61 v25.4,34.61
  Bottom 0.305: J4.6 19.05,5.08 17.78,6.35 15.24,6.35 10.79,10.79 10.79,28.89 16.51,34.61 v25.4,34.61
AN3  (via drill 0.2)
  Top 0.203: U1.10 28.73,32.55 27.94,33.34 v26.67,33.34
  Bottom 0.305: v26.67,33.34 16.19,33.34 11.43,28.57 11.43,11.11 15.56,6.99 19.68,6.99 21.59,5.08 J4.7
AN4  (via drill 0.2)
  Top 0.203: U1.11 28.23,32.41 27.94,32.7 v27.3,32.7
  Bottom 0.305: v27.3,32.7 16.51,32.7 12.06,28.26 12.06,11.43 15.88,7.62 21.59,7.62 24.13,5.08 J4.8
CS0  (via drill 0.2)
  Top 0.203: U1.34 32.23,23.65 32.7,23.18 32.7,20.64 30.8,18.73 v15.24,18.73
  Top 0.305: v15.24,15.56 15.24,13.65 23.5,5.4 39.05,5.4 39.37,5.08 J4.14
  Bottom 0.305: v15.24,18.73 v15.24,15.56
CS1  (via drill 0.2)
  Top 0.203: U1.21 25.1,27.01 24.13,26.04 v16.19,26.04
  Top 0.305: J4.15 41.91,5.08 40.96,6.03 23.81,6.03 16.19,13.65 v16.19,15.56
  Bottom 0.305: v16.19,15.56 v16.19,26.04
EN  (via drill 0.2)
  Top 0.203: U1.9 29.23,32.68 27.94,33.97 v26.04,33.97 | Q3.3 37.61,45.09 | 24.45,48.79 R16.1 24.45,49 | 24.45,51.02 C11.1
  Top 0.254: 37.61,45.09 v36.51,45.09 | v25.72,45.09 25.72,46.04 24.45,47.31 24.45,48.79 | 24.45,49 24.45,51.02 | C11.1 24.45,51.22 24.45,55.07 S1.1
  Top 0.305: J2.2 55.88,53.34 47.62,45.09 v45.4,45.09
  Bottom 0.254: v36.51,45.09 v25.72,45.09
  Bottom 0.305: v26.04,33.97 26.04,35.24 25.72,35.56 v25.72,45.09 | v45.4,45.09 v36.51,45.09
EXT-5V-IN  (via drill 0.3)
  Top 0.305: Q1.1 56.83,38.15 56.83,38.73 56.2,39.37 v54.61,39.37
  Top 0.508: D4.A v54.61,39.37
  Bottom 0.508: J3.1 8.26,58.42 8.89,57.78 21.91,57.78 25.4,61.28 51.75,61.28 54.61,58.42 | v54.61,39.37 54.61,58.1 | 54.61,58.1 54.61,58.42 | J2.4 54.93,58.42 | 54.93,58.42 54.61,58.42 | 54.93,58.42 54.61,58.1
GND  (via drill 0.2, 0.3)
  Top 0.254: C11.2 v27.3,51.12 | C10.2 v27.3,51.12 | S1.2 27.07,55.16 27.3,54.93 | S2.4 27.54,55.16 27.3,54.93 | 27.3,54.93 v27.3,51.12
  Top 0.305: C9.2 v20.64,27.94 | D6.C 54.29,25.32 v54.29,24.45 | R19.1 v46.35,27.62 | C3.2 v49.85,29.84 | Q1.2 v56.2,36.2 | C2.2 v49.53,38.42 | C8.2 v39.37,32.38 | C14.2 v39.37,29.53 | C4.2 v39.69,23.81 | R12.1 26.77,9.53 v28.57,9.53 30.4,9.53 D5.C | C7.2 26.57,15.56 25.72,15.56 v24.77,14.61 | C6.2 v31.11,37.78 | C5.2 v34.92,36.83 | R2.1 v6.99,52.07 | R1.1 v6.99,50.16 | U2.1 17.26,47.51 v17.46,47.31 | C1.2 v34.61,55.56 | C13.2 34.92,53.34 v34.61,53.66 | U3.16 39.69,54.29 v39.37,53.98 | U3.6 47.31,54.93 v47.94,55.56
  Top 0.508: C3.2 50.8,29.95 v50.8,32.7 U4.2 | J1.B1 13.31,53.95 v13.02,53.66 | J1.A1 19.71,53.95 v20,53.66
  other vias: 28.57,30.16 29.53,30.16 30.48,30.16 31.43,30.16 31.43,29.21 30.48,29.21 29.53,29.21 28.57,29.21 28.57,28.26 28.57,27.3 28.57,26.35 29.53,26.35 30.48,26.35 31.43,26.35 32.38,26.35 32.38,27.3 32.38,28.26 32.38,29.21 31.43,28.26 30.48,28.26 29.53,28.26 29.53,27.3 30.48,27.3 31.43,27.3
  pour Route2 (isolate 0.406): 0.95,60.96 0.95,0.95 60.01,0.95 60.01,60.96
IO0  (via drill 0.2)
  Top 0.203: U1.23 25.44,26.01 23.57,24.13 20.64,24.13 20.32,24.45 v8.26,24.45 | 30.16,48.79 R17.1 30.16,49 | 30.16,51.02 C10.1 30.16,51.22 | Q2.3 33.8,45.09
  Top 0.254: 30.16,49 30.16,51.02 | 33.8,45.09 32.7,45.09 | S2.3 30.16,55.07 30.16,51.22
  Top 0.305: 30.16,48.79 v30.16,46.04 31.11,45.09 32.7,45.09
  Bottom 0.305: v8.26,24.45 8.26,30.16 24.13,46.04 v30.16,46.04
IRQ0  (via drill 0.2)
  Top 0.203: U1.5 31.23,33.22 27.94,36.51 v23.5,36.51
  Bottom 0.305: v23.5,36.51 15.56,36.51 8.89,29.84 8.89,7.62 6.35,5.08 J4.1
LEDBTN  (via drill 0.2)
  Top 0.203: U1.22 25.24,26.51 24.13,25.4 21.27,25.4 v20.95,25.08
  Top 0.305: R10.1 34.39,9.53 35.24,9.53 35.56,9.84 v35.56,15.24 35.24,15.56 34.39,15.56 R14.1
  Bottom 0.305: v35.56,15.24 35.24,15.56 22.86,15.56 20.95,17.46 v20.95,25.08
LX
  Top 0.508: U4.3 54.61,33.65 L2.2
N$1
  Top 0.29: U1.2 32.73,33.63 arc1 32.68,38.46 arc55 ANT1.RF
N$2  (via drill 0.2)
  Top 0.305: J1.B5 14.76,53.41 v15.15,53.02 | v10.79,52.07 R2.2
  Bottom 0.305: v15.15,53.02 15.15,52.62 14.92,52.39 11.11,52.39 v10.79,52.07
N$3  (via drill 0.2)
  Top 0.305: J1.A5 17.76,53 v17.46,52.7 | v10.79,50.16 R1.2
  Bottom 0.305: v17.46,52.7 16.51,51.75 12.38,51.75 v10.79,50.16
N$4  (via drill 0.2, 0.3)
  Top 0.305: U2.4 13.97,47.14 13.97,46.35 14.29,46.04 19.37,46.04 v19.69,46.36 | R7.1 47.31,38.73 47.94,39.37 v51.75,39.37 | U3.15 39.05,54.93 38.42,54.29 38.42,53.66 38.1,53.34 C13.1 37.47,53.24 v37.47,52.39
  Top 0.508: D3.A v51.75,39.37 | L1.2 v19.69,46.36
  Bottom 0.305: v37.47,52.39 37.47,60.01 | 37.47,60.33 37.47,60.01 | 37.47,60.01 37.15,60.33 | 37.47,60.01 37.78,60.33
  Bottom 0.508: v19.69,46.36 33.66,60.33 37.15,60.33 37.47,60.33 37.78,60.33 51.44,60.33 53.66,58.1 53.66,41.27 v51.75,39.37
N$5
  Top 0.61: FB2.1 21.27,51.33 21.27,49.85 21.59,49.53 L1.1
N$6  (via drill 0.2)
  Top 0.254: U2.3 11.74,49.21 11.11,48.58 v11.11,47.94 | v34.29,59.37 34.92,60.01 R4.1
  Top 0.305: U2.3 14.14,50.02 15.76,51.64 J1.B6 15.76,56.72 15.88,56.83 16.51,56.83 16.76,56.58 J1.A6
  Bottom 0.254: v11.11,47.94 11.11,45.4 12.38,44.13 20.95,44.13 23.81,46.99 29.84,46.99 36.83,53.98 36.83,57.78 35.24,59.37 v34.29,59.37
N$7  (via drill 0.2)
  Top 0.254: U2.2 16.19,49.21 15.24,48.26 12.38,48.26 v12.06,47.94 | v34.29,58.42 34.92,57.78 R3.1
  Top 0.305: J1.A7 16.26,53.02 | 16.26,53.02 16.26,49.29 U2.2 | J1.B7 17.26,53.45 16.83,53.02 16.26,53.02
  Bottom 0.254: v12.06,47.94 12.06,45.72 13.02,44.77 20.64,44.77 23.5,47.62 29.53,47.62 36.2,54.29 36.2,57.15 34.92,58.42 v34.29,58.42
N$8
  Top 0.305: U3.11 40.01,57.47 37.47,60.01 R4.2
N$9
  Top 0.305: 39.69,55.56 U3.14 42.23,55.56 44.77,53.02 U3.3 47.62,53.02 48.26,53.66 D2.A 49.21,53.73 49.21,55.8 D1.A | 39.69,55.56 C1.1 | U3.13 40.32,56.2 39.69,55.56
N$10
  Top 0.305: U3.12 39.37,56.83 38.42,57.78 R3.2
N$11
  Top 0.305: R5.2 51.12,51.54 51.12,53.58 D2.C
N$12
  Top 0.305: R6.2 51.12,58 51.12,55.96 D1.C
N$13
  Top 0.305: R5.1 48.58,51.44 46.99,49.85 43.81,49.85 42.55,51.12 42.55,53.34 42.23,53.66 U3.17
N$14
  Top 0.305: U3.10 47.62,57.47 48.26,58.1 R6.1
N$16  (via drill 0.2)
  Top 0.203: U1.41 39.57,27.51 v40.01,27.94 | v42.23,27.94 42.23,43.5 43.81,45.09 R8.1
  Bottom 0.203: v40.01,27.94 v42.23,27.94
N$17
  Top 0.203: U1.40 40.34,27.01 41.27,27.94 R9.1
N$18
  Top 0.305: Q3.1 38.73,47.3 37.78,46.35 34.29,46.35 33.97,46.67 33.97,48.58 34.29,48.9 34.29,50.8 33.97,51.12 33.12,51.12 R15.1
N$19
  Top 0.305: R10.2 34.19,11.43 30.55,11.43 D5.A
N$20
  Top 0.305: S3.2 27.85,13.88 27.62,13.65 26.77,13.65 | 26.77,13.65 C7.1 | R12.2 26.67,12.38 | 26.67,12.38 26.67,12.7 | 26.67,12.7 26.67,13.02 | 26.67,13.02 26.67,13.55 26.77,13.65 | R14.2 34.29,13.02 33.97,12.7 26.99,12.7 | 26.67,12.7 26.99,12.7 | 26.67,13.02 26.99,12.7 | 26.99,12.7 26.67,12.38
N$21
  Top 0.305: R13.1 56.2,27.52 56.2,25.48 D6.A
N$22
  Top 0.305: Q2.1 34.92,50.8 35.24,51.12 36.73,51.12 R11.1
N$23  (via drill 0.2)
  Top 0.203: U1.26 28.23,21.56 27.62,20.95 v27.62,20.64
  Bottom 0.203: v27.62,20.64 27.62,19.68 28.89,18.41 38.42,18.41 TP1.TP
  other vias: 38.73,18.1
N$24  (via drill 0.2)
  Top 0.203: U1.25 27.73,21.7 v26.67,20.64
  Bottom 0.203: v26.67,20.64 26.67,19.37 28.57,17.46 TP2.TP
  other vias: 37.15,17.46
N$25  (via drill 0.2)
  Top 0.203: U1.27 28.73,20.79 v28.57,20.64
  Bottom 0.203: v28.57,20.64 28.57,19.68 29.21,19.05 40.01,19.05 40.32,18.73 TP3.TP
  other vias: 40.32,17.46
N$26  (via drill 0.2)
  Top 0.203: U1.30 v30.23,19.61 v30.24,19.61
  Bottom 0.203: v30.24,19.61 30.32,19.68 41.27,19.68 41.91,19.05 TP4.TP
  other vias: 41.91,18.1
N$27  (via drill 0.2)
  Top 0.203: U1.33 31.73,21.93 v32.07,21.59
  Bottom 0.203: v32.07,21.59 46.04,21.59 46.67,20.95 TP7.TP
  other vias: 46.67,17.46
N$28  (via drill 0.2)
  Top 0.203: U1.32 31.23,21.16 v31.43,20.95
  Bottom 0.203: v31.43,20.95 44.45,20.95 45.09,20.32 TP6.TP
  other vias: 45.09,18.1
N$29  (via drill 0.2)
  Top 0.203: U1.31 30.8,24.74 v30.8,20.32
  Bottom 0.203: v30.8,20.32 42.86,20.32 43.5,19.68 TP5.TP
  other vias: 43.5,17.46
P!DTR  (via drill 0.2)
  Top 0.305: Q2.2 v33.02,48.58 R15.2 | U3.1 45.86,51.75 45.4,51.3 v45.4,50.8
  Bottom 0.305: v45.4,50.8 45.4,51.44 45.09,51.75 44.13,51.75 42.55,50.16 34.61,50.16 v33.02,48.58
P!RTS  (via drill 0.2)
  Top 0.305: Q3.2 36.83,49.21 | 36.83,49.21 R11.2 | U3.2 44.77,52.39 44.45,52.07 v44.45,50.8 | v38.73,49.21 36.83,49.21
  Bottom 0.305: v44.45,50.8 42.86,49.21 v38.73,49.21
P-0
  Top 0.203: U1.12 27.35,31.71 24.45,34.61 19.68,34.61 6.03,48.26 J3.5
P-1
  Top 0.203: J3.6 7.62,45.72 19.37,33.97 24.13,33.97 26.35,31.75 26.35,31.11 26.46,31.01 U1.13
P-2
  Top 0.203: J3.7 9.21,43.18 19.05,33.34 23.81,33.34 25.72,31.43 25.72,31.11 26.32,30.51 U1.14
P-3
  Top 0.203: U1.15 26.19,30.01 23.5,32.7 18.73,32.7 10.79,40.64 J3.8
P-4
  Top 0.203: U1.16 25.74,29.51 23.18,32.07 18.41,32.07 12.38,38.1 J3.9
P-5  (via drill 0.2)
  Top 0.203: U1.17 25.29,29.01 22.86,31.43 v18.1,31.43 13.97,35.56 J3.10
  Top 0.305: J4.16 44.45,5.08 42.86,6.67 24.13,6.67 17.14,13.65 v17.14,15.56
  Bottom 0.305: v17.14,15.56 17.14,30.8 17.78,31.43 v18.1,31.43
P-6  (via drill 0.2)
  Top 0.203: U1.18 24.83,28.51 22.86,30.48 v18.1,30.48 17.14,30.48 14.61,33.02 J3.11
  Top 0.305: J4.17 46.99,5.08 44.77,7.3 24.45,7.3 18.1,13.65 v18.1,15.56
  Bottom 0.305: v18.1,15.56 v18.1,30.48
P-7  (via drill 0.2)
  Top 0.203: U1.20 24.97,27.51 24.13,26.67 19.37,26.67 v19.05,26.99 15.56,30.48 J3.12
  Top 0.305: J4.18 49.53,5.08 46.67,7.94 24.77,7.94 19.05,13.65 v19.05,15.56
  Bottom 0.305: v19.05,15.56 v19.05,26.99
P-8  (via drill 0.2)
  Top 0.203: U1.24 25.82,25.51 23.81,23.5 v20,23.5 7.94,23.5 5.71,25.72 5.71,27.3 5.08,27.94 J3.13
  Top 0.305: J4.19 52.07,5.08 48.58,8.57 25.08,8.57 20,13.65 v20,15.56
  Bottom 0.305: v20,15.56 v20,23.5
P-9
  Top 0.203: U1.28 29.23,20.34 28.89,20 7.3,20 6.35,20.95 6.35,24.13 5.08,25.4 J3.14
P-10
  Top 0.203: U1.29 29.73,19.89 29.21,19.37 6.99,19.37 5.71,20.64 5.71,22.23 5.08,22.86 J3.15
P-11  (via drill 0.2)
  Top 0.203: U1.35 32.73,23.86 33.37,23.22 33.37,20.35 31.11,18.1 22.54,18.1 22.23,17.78 v14.29,17.78 7.62,17.78 5.08,20.32 J3.16
  Bottom 0.305: J4.13 36.83,5.08 33.66,8.26 23.81,8.26 22.54,9.53 17.46,9.53 14.29,12.7 v14.29,17.78
P-12  (via drill 0.2)
  Top 0.203: U1.36 33.23,24.17 33.87,23.54 33.87,19.89 31.43,17.46 22.86,17.46 22.54,17.14 v13.02,17.14 5.71,17.14 5.08,17.78 J3.17
  Bottom 0.305: J4.11 31.75,5.08 29.84,6.99 23.18,6.99 21.91,8.26 16.51,8.26 13.02,11.75 v13.02,17.14
P-13  (via drill 0.2)
  Top 0.203: U1.38 35.59,26.01 36.2,25.4 40.01,25.4 40.64,24.77 40.64,22.86 34.61,16.83 23.18,16.83 22.86,16.51 v13.65,16.51 6.67,16.51 5.4,15.24 J3.18
  Bottom 0.305: J4.12 34.29,5.08 31.75,7.62 23.5,7.62 22.23,8.89 16.83,8.89 13.65,12.06 v13.65,16.51
P-14  (via drill 0.2)
  Top 0.203: U1.39 40.17,26.51 v40.32,26.35
  Top 0.305: J4.10 29.21,2.54 27.94,1.27 3.81,1.27 1.91,3.17 1.91,12.06 2.54,12.7 J3.19
  Bottom 0.305: J4.10 29.21,2.54 29.84,1.91 55.88,1.91 56.83,2.86 56.83,9.84 47.62,19.05 47.62,20.95 42.23,26.35 v40.32,26.35
P-15  (via drill 0.2)
  Top 0.203: U1.42 38.8,28.01 39.69,28.89 v40.32,28.89
  Top 0.305: J4.9 26.67,2.54 26.04,1.91 5.08,1.91 3.81,3.17 J3.20
  Bottom 0.305: J4.9 26.67,2.54 27.94,1.27 56.52,1.27 57.78,2.54 57.78,10.16 48.26,19.68 48.26,21.59 43.81,26.04 43.81,27.94 42.86,28.89 v40.32,28.89
PRXD  (via drill 0.2)
  Top 0.305: v43.81,48.9 R8.2 | U3.4 47.31,53.66 v48.26,54.61
  Bottom 0.305: v48.26,54.61 48.26,50.16 46.99,48.9 v43.81,48.9
PTXD
  Top 0.305: U3.20 40.32,51.75 40.01,51.44 40.01,50.16 41.27,48.9 R9.2
VBUS  (via drill 0.3)
  Top 0.61: J1.A4 18.91,51.99 | 18.91,51.99 FB2.2 v18.1,51.44 18.35,51.44 18.91,51.99 | J1.B4 14.11,51.72 v13.34,50.95
  Bottom 0.61: v13.34,50.95 17.61,50.95 v18.1,51.44
VFB
  Top 0.305: R18.1 50.8,25.5 50.8,27.52 C12.2 R19.2 49.21,27.73 49.21,31.57 U4.6
VIN
  Top 0.508: D4.C 54.59,36.2 51.77,36.2 D3.C 51.41,35.88 49.63,35.88 C2.1 49.53,34.92 49.21,34.61 49.21,33.84 U4.4

### Text on the board
tPlace: 5VIN | 3V3 | GND | IO32 | IO33 | IO25 | IO26 | IO27 | IO14 | IO12 | IO13 | IO4 | SD2 | SD3 | IO18 | IO23 | IO19 | IO22 | IO21 | VP | CP | CN | VN | IO34 | IO35 | IO21 | IO22 | IO23 | IO19 | IO18 | IO5 | IO15 | IO14 | IO12 | IO13 | IO4 | GND